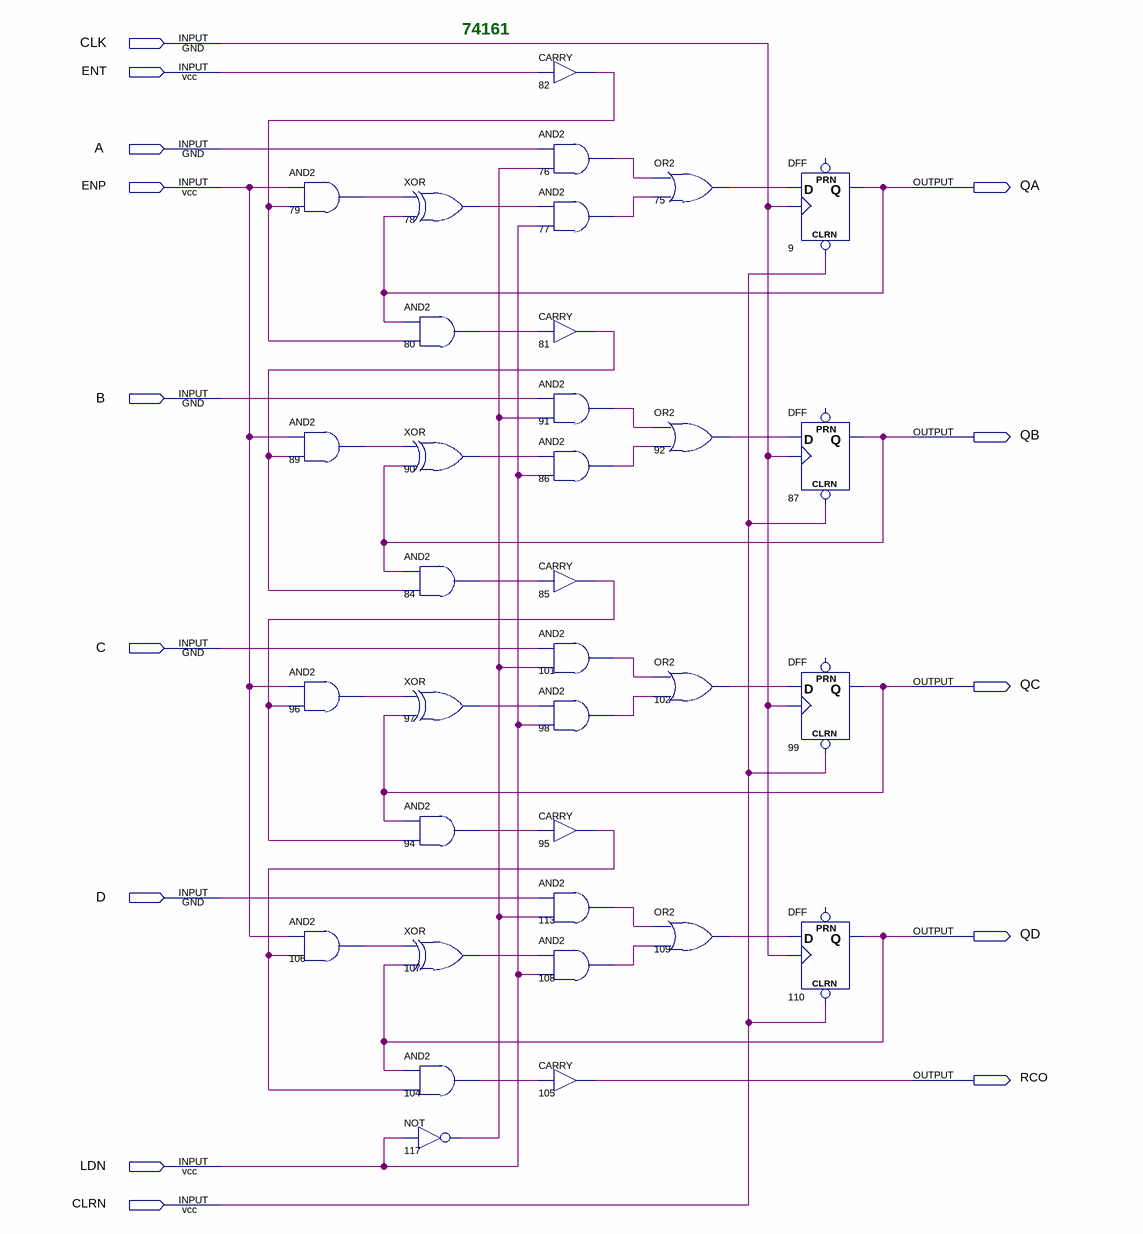
[diagram p0: schematic sheet]
// Quartus schematic f74161.bdf as structural Verilog: 34 symbols, 14 pins
module f74161 (
  input  CLK,
  input  ENT,
  input  A,
  input  ENP,
  input  B,
  input  C,
  input  D,
  input  LDN,
  input  CLRN,
  output QA,
  output QB,
  output QC,
  output QD,
  output RCO
);

  wire n75_out, n76_out, n77_out, n78_out, n79_out, n80_out, n81_out, n82_out, n84_out, n85_out, n86_out,
       n89_out, n90_out, n91_out, n92_out, n94_out, n95_out, n96_out, n97_out, n98_out, n101_out, n102_out,
       n104_out, n106_out, n107_out, n108_out, n109_out, n113_out, n117_out;

  and u_79 (n79_out, ENP, n82_out);
  and u_89 (n89_out, ENP, n81_out);
  and u_96 (n96_out, ENP, n85_out);
  and u_106 (n106_out, ENP, n95_out);
  xor u_78 (n78_out, n79_out, QA);
  and u_80 (n80_out, QA, n82_out);
  xor u_90 (n90_out, n89_out, QB);
  and u_84 (n84_out, QB, n81_out);
  xor u_97 (n97_out, n96_out, QC);
  and u_94 (n94_out, QC, n85_out);
  xor u_107 (n107_out, n106_out, QD);
  and u_104 (n104_out, QD, n95_out);
  not u_117 (n117_out, LDN);
  CARRY u_82 (.IN(ENT), .OUT(n82_out));
  and u_76 (n76_out, A, n117_out);
  and u_77 (n77_out, n78_out, LDN);
  CARRY u_81 (.IN(n80_out), .OUT(n81_out));
  and u_91 (n91_out, B, n117_out);
  and u_86 (n86_out, n90_out, LDN);
  CARRY u_85 (.IN(n84_out), .OUT(n85_out));
  and u_101 (n101_out, C, n117_out);
  and u_98 (n98_out, n97_out, LDN);
  CARRY u_95 (.IN(n94_out), .OUT(n95_out));
  and u_113 (n113_out, D, n117_out);
  and u_108 (n108_out, n107_out, LDN);
  CARRY u_105 (.IN(n104_out), .OUT(RCO));
  or u_75 (n75_out, n76_out, n77_out);
  or u_92 (n92_out, n91_out, n86_out);
  or u_102 (n102_out, n101_out, n98_out);
  or u_109 (n109_out, n113_out, n108_out);
  DFF u_9 (.CLRN(CLRN), .CLK(CLK), .D(n75_out), .Q(QA));  // open: PRN
  DFF u_87 (.CLRN(CLRN), .CLK(CLK), .D(n92_out), .Q(QB));  // open: PRN
  DFF u_99 (.CLRN(CLRN), .CLK(CLK), .D(n102_out), .Q(QC));  // open: PRN
  DFF u_110 (.CLRN(CLRN), .CLK(CLK), .D(n109_out), .Q(QD));  // open: PRN

  // Notes on the sheet:
  //   74161
endmodule
